# Altium schematic sheet Wifi Relay V3.SchDoc
size A
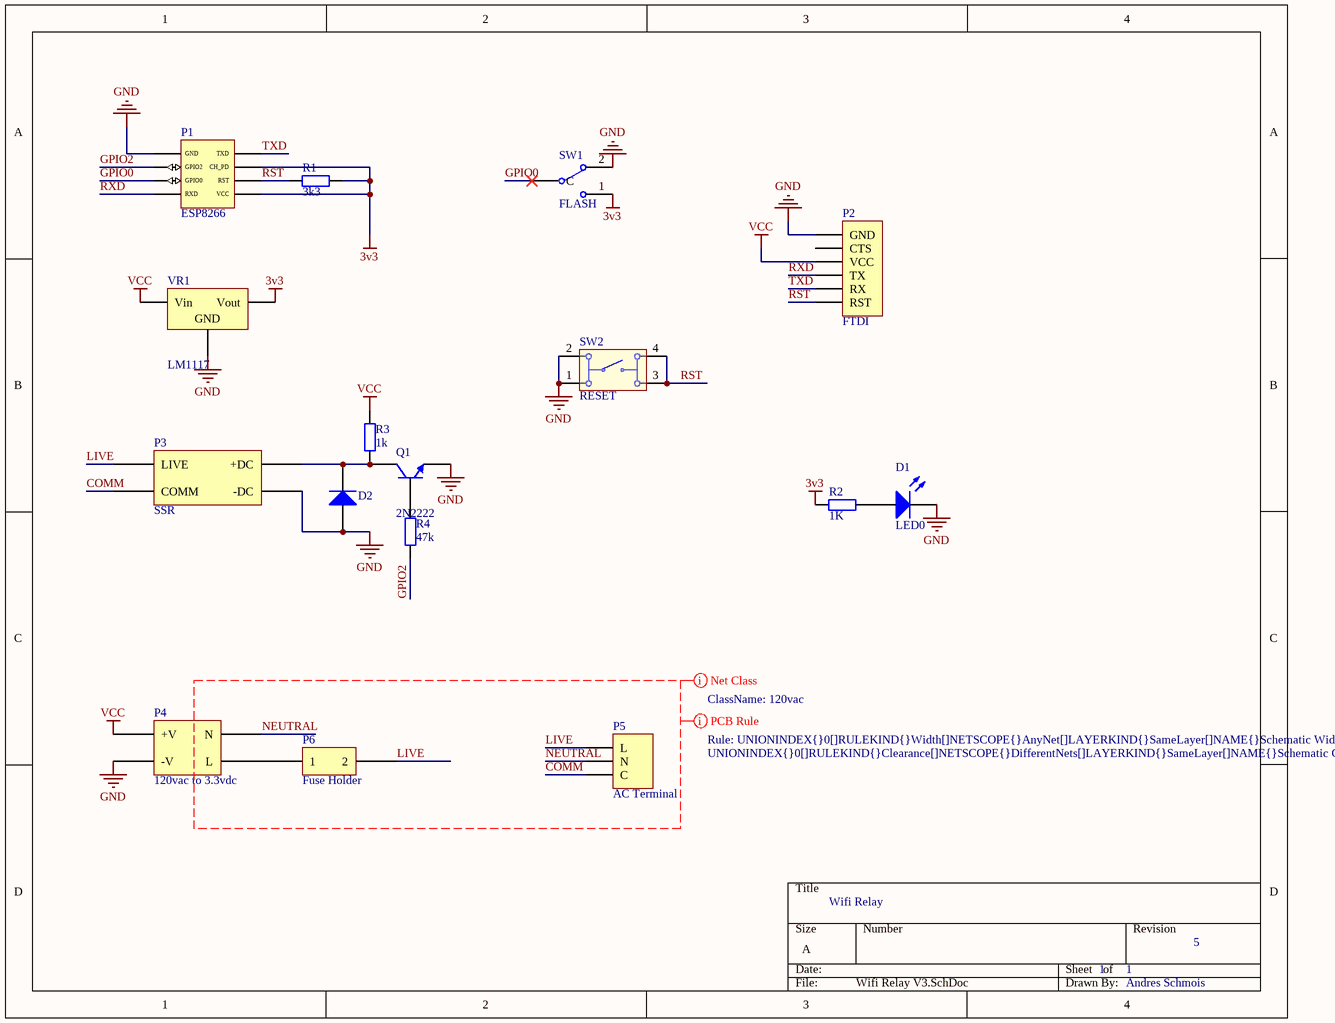
[diagram p0: Wifi Relay V3.SchDoc]

## Parts
D1  LED0  [LED]
D2  Diode  [DO-35]  (value not drawn)
P1  ESP8266  [ESP8266]
P2  FTDI  [HDR1X6]
P3  SSR  [Relay]
P4  120vac to 3.3vdc  [120vac to 3.3vdc]
P5  AC Terminal  [AC Terminal]
P6  Fuse Holder  [Fuse Holder]
Q1  2N2222  [TO-92A]
R1  3k3  [AXIAL-0.4]
R2  1K  [AXIAL-0.4]
R3  1k  [AXIAL-0.4]
R4  47k  [AXIAL-0.4]
SW1  FLASH  [SWITCH]
SW2  RESET  [MINI PUSH BUTTON]
VR1  LM1117  [TO-220-AB]

## Nets
3v3: P1.6(CH_PD) P1.8(VCC) R1.2 R2.1 SW1.1 VR1.2(Vout)
GND: D1.2(K) D2.1(A) P1.1(GND) P2.1(GND) P3.4(-DC) P4.-V Q1.1(E) SW1.2 SW2.1 SW2.2 VR1.1(GND)
VCC: P2.3(VCC) P4.+V R3.2 VR1.3(Vin)
COMM: P3.1(COMM) P5.3(C)
GPIO0: P1.3(GPIO0) SW1.C
GPIO2: P1.2(GPIO2) R4.1
LIVE: P3.2(LIVE) P5.1(L) P6.2
NEUTRAL: P4.N P5.2(N)
RST: P1.7(RST) P2.6(RST) R1.1 SW2.3 SW2.4
RXD: P1.4(RXD) P2.4(TX)
TXD: P1.5(TXD) P2.5(RX)
NetD1_1: D1.1(A) R2.2
NetD2_2: D2.2(K) P3.3(+DC) Q1.3(C) R3.1
NetP4_L: P4.L P6.1
NetQ1_2: Q1.2(B) R4.2

Not connected (* = marked no-connect by the designer): P2 2(CTS)

## Layout directives
net class 120vac: COMM, LIVE, NEUTRAL
rule Width Constraint [Pref Width = 0.8mm    Min Width = 0.8mm    Max Width = 10mm]; rule Clearance Constraint [Clearance = 1.35mm]: COMM, LIVE, NEUTRAL

## Notes on the sheet
- Wifi Relay
- 1
- 5
- Andres Schmois

## Library data of the parts
D1 = LED0: Typical INFRARED GaAs LED; Published: 8-Jun-2000; LatestRevisionDate: 08-Jul-2005; LatestRevisionNote: Mech Layer 1 removed.; PackageReference: LED-0; Publisher: Altium Limited; PackageDescription: LED; 2 Leads
D2 = Diode 1N914: High Conductance Fast Diode; Published: 8-Jun-2000; LatestRevisionDate: 17-Jul-2002; LatestRevisionNote: Re-released for DXP Platform.; DatasheetVersion: 1997; PackageReference: DO-35; Publisher: Altium Limited; PackageDescription: Diode, Axial; Body 3.8 x 1.9 mm (LxDia. max), Lead Dia. 0.53 mm (max); Code_JEDEC: DO-204-AH; ComponentLink1Description: Manufacturer Link; ComponentLink1URL: http://www.fairchildsemi.com/; ComponentLink2Description: Datasheet; ComponentLink2URL: http://www.fairchildsemi.com/ds/1N%2F1N4448.pdf
P1 = Header 4X2A: Header, 4-Pin, Dual row; LatestRevisionDate: 17-Jul-2002; LatestRevisionNote: Re-released for DXP Platform.; Publisher: Altium Limited
P2 = Header 6: Header, 6-Pin; LatestRevisionDate: 17-Jul-2002; LatestRevisionNote: Re-released for DXP Platform.; Publisher: Altium Limited
P5 = Header 3: Header, 3-Pin; LatestRevisionDate: 17-Jul-2002; LatestRevisionNote: Re-released for DXP Platform.; Publisher: Altium Limited
Q1 = 2N3904: NPN 2N2222; Published: 8-Jun-2000; LatestRevisionDate: 15-Jan-2003; LatestRevisionNote: PCB Footprint 'BCY-W3/D4.7' replaced; DatasheetVersion: 1997; PackageVersion: Sep-1998; PackageReference: TO-92A; Publisher: Altium Limited; PackageDescription: TO, Flat Index; 3 In-Line, Axial Leads; Body Dia. 4.5mm; Leads 0.51 x 0.48 mm (max); ComponentLink1Description: Manufacturer Link; ComponentLink1URL: http://www.fairchildsemi.com/; ComponentLink2Description: Datasheet; ComponentLink2URL: http://www.fairchildsemi.com/ds/2N%2F2N3904.pdf
R1 R2 = Res2: Resistor; Published: 8-Jun-2000; LatestRevisionDate: 17-Jul-2002; LatestRevisionNote: Re-released for DXP Platform.; PackageReference: AXIAL-0.4; Publisher: Altium Limited; PackageDescription: Axial Device, Thru-Hole; 2 Leads; 0.4 in Pin Spacing
  R1: Value: 3k3
R3 = Res2: Resistor; Value: 3k3; Published: 8-Jun-2000; LatestRevisionDate: 17-Jul-2002; LatestRevisionNote: Re-released for DXP Platform.; PackageReference: AXIAL-0.4; Publisher: Altium Limited; PackageDescription: Axial Device, Thru-Hole; 2 Leads; 0.4 in Pin Spacing
R4 = Res2: Resistor; Value: 1K; Published: 8-Jun-2000; LatestRevisionDate: 17-Jul-2002; LatestRevisionNote: Re-released for DXP Platform.; PackageReference: AXIAL-0.4; Publisher: Altium Limited; PackageDescription: Axial Device, Thru-Hole; 2 Leads; 0.4 in Pin Spacing
SW1 = SW-SPDT: SPDT Subminiature Toggle Switch, Right Angle Mounting, Vertical Actuation; Published: 24-Mar-1999; LatestRevisionDate: 17-Dec-2003; LatestRevisionNote: Schematic revised, PCB Footprint replaced.; PackageReference: TL36WW15050; Publisher: Altium Limited; PackageDescription: Switch; 4 Leads; DatasheetVersion: 05-Dec-2000; ComponentLink1Description: Manufacturer Link; ComponentLink1URL: http://www.apem.com
SW2 = WE-Tact Switches WS-TATV 430456085736: WS-TATV THT Tact Switch 12X12 mm; Manufacturer: W¨¹rth Elektronik eiSos GmbH & Co.KG; ComponentLink1 Description: Manufacturer; ComponentLink2 Description: Datasheet; Creat by: Karrer Zheng; NoPins: 04; Creat Date: 28 February 2014; partNo: 430456085736; ComponentLink1URL: http://www.we-online.com; ComponentLink2URL: http://katalog.we-online.de/em/datasheet/430456085736.pdf
VR1 = Volt Reg: Voltage Regulator; Published: 24-Mar-1999; LatestRevisionDate: 29-May-2009; LatestRevisionNote: IPC-7351 Footprint Added.; PackageReference: D2PAK; Publisher: Altium Limited; PackageDescription: 3-Pin Transistor Outline Package 2.54 mm Pitch, 15.1 mm Lead Span